# Altium schematic sheet Microphone MAX9814.SchDoc
size 209 x 297 mm; Author: Мурашкин Д.В.; Address1: Address1; Address2: Address2; Address3: Address3; Address4: Address4; DocumentNumber: SS19946-01; Scale: 1:1; Letter1Column: Э; PartName: Контроллер батареи
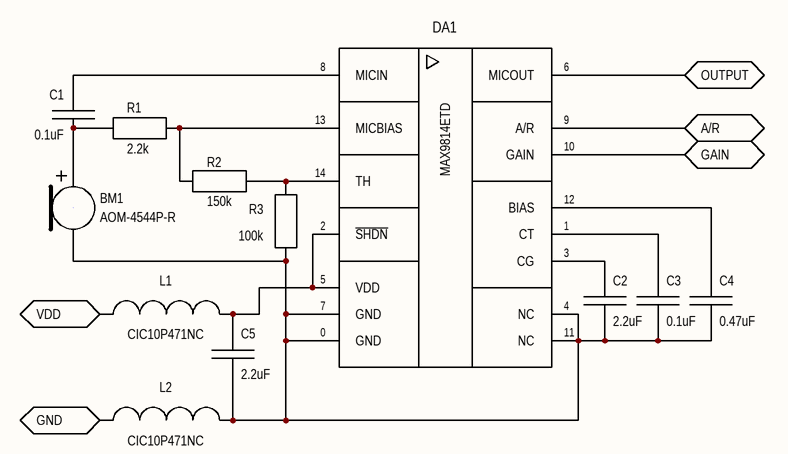
[diagram p0: Microphone MAX9814.SchDoc]

## Parts
BM1  AOM-4544P-R  [Electret microphone d9.7x4.5mm]
C1  0.1uF  [CAPC1608L]
C2  2.2uF  [CAPC2012L]
C3  0.1uF  [CAPC1608L]
C4  0.47uF  [CAPC1608L]
C5  2.2uF  [CAPC2012L]
DA1  MAX9814ETD  [TDFN-EP-14]
L1  CIC10P471NC  [FB1608L]
L2  CIC10P471NC  [FB1608L]
R1  2.2k  [RESC1608L]
R2  150k  [RESC1608L]
R3  100k  [RESC1608L]

## Ports
A/R, GAIN, GND, OUTPUT, VDD

## Nets
A/R: DA1.9(A/R) ; port A/R
GAIN: DA1.10(GAIN) ; port GAIN
GND: L2.1 ; port GND
OUTPUT: DA1.6(MICOUT) ; port OUTPUT
VDD: L1.1 ; port VDD
NetBM1_1: BM1.1(+) C1.2 R1.1
NetBM1_2: BM1.2(-) C2.2 C3.2 C4.2 C5.2 DA1.0(GND) DA1.4(NC) DA1.7(GND) DA1.11(NC) L2.2 R3.2
NetC1_1: C1.1 DA1.8(MICIN)
NetC2_1: C2.1 DA1.3(CG)
NetC3_1: C3.1 DA1.1(CT)
NetC4_1: C4.1 DA1.12(BIAS)
NetC5_1: C5.1 DA1.2(~{SHDN}) DA1.5(VDD) L1.2
NetDA1_13: DA1.13(MICBIAS) R1.2 R2.2
NetDA1_14: DA1.14(TH) R2.1 R3.1

## Notes on the sheet
- Перв. примен.
- Справ. №
- Подп. и дата
- Инв. № дубл.
- Взам. инв. №
- Разраб.
- Изм.
- Лист
- № докум.
- Подп.
- Дата
- Лит.
- Масса
- Масштаб
- Пров.
- Т.контр.
- Листов
- Инв. № подл.
- Утв.
- Н.контр.
- 2.106-A4
- Копировал
- Формат А4

## Library data of the parts
BM1 = Electret microphone d9.4x6.7mm: Manufacturer: PUI Audio; Group: Microphones; Part name: AOM-4544P-R; Package: d9.7x4.5mm
C1 C3 = Capacitor Ceramic 0.1uF 25V 0603(1608): Group: Ceramic Capacitors; Temperature Coefficient: X7R; Tolerance: ±10%; Type: Ceramic; Voltage: 25V; Package: 0603 (1608); Value: 0.1uF
C2 C5 = Capacitor Ceramic 2.2uF 50V 0805(2012): Group: Ceramic Capacitors; Temperature Coefficient: X5R; Tolerance: ±10%; Type: Ceramic; Voltage: 50V; Package: 0805 (2012); Value: 2.2uF
C4 = Capacitor Ceramic 0.47uF 10V 0603(1608): Group: Ceramic Capacitors; Temperature Coefficient: X7R; Tolerance: ±10%; Type: Ceramic; Voltage: 10V; Package: 0603 (1608); Value: 0.47uF
DA1 = MAX9814ETD: Microphone Amplifier with AGC and Low-Noise Microphone Bias; Manufacturer: Maxim Integrated; Group: Linear - Amplifiers - Audio; Part name: MAX9814ETD; Package: WFDFN-14
L1 L2 = CIC10P471NC: Ferrite Bead 1.2A 470Ohm; Manufacturer: Samsung Electro-Mechanics America; Group: Ferrite Beads and Chips; Current Rating: 1.7A; Part name: CIC10P471NC; Package: 1608
R1 = Resistor Ceramic 2.2k 0.1W 0603(1608): Group: Resistors; Temperature Coefficient: ±100ppm/°C; Tolerance: ±5%; Type: Thin Film; Power: 0.1W; Package: 0603 (1608); Value: 2.2k
R2 = Resistor Ceramic 150k 0.1W 0603(1608): Group: Resistors; Temperature Coefficient: ±100ppm/°C; Tolerance: ±5%; Type: Thin Film; Power: 0.1W; Package: 0603 (1608); Value: 150k
R3 = Resistor Ceramic 100k 0.1W 0603(1608): Group: Resistors; Temperature Coefficient: ±100ppm/°C; Tolerance: ±5%; Type: Thin Film; Power: 0.1W; Package: 0603 (1608); Value: 100k